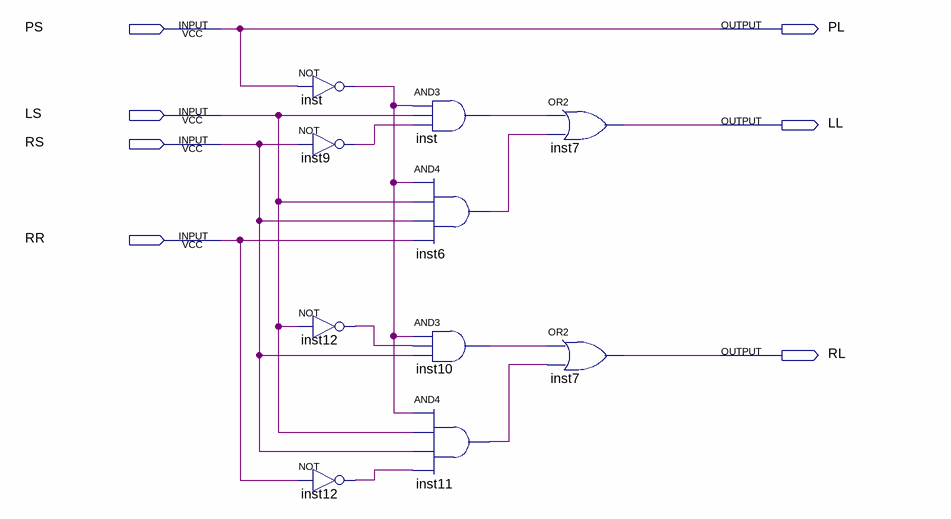
[diagram p0: schematic sheet]
// Quartus schematic Lab01_B0729008_2.bdf as structural Verilog: 10 symbols, 7 pins
module Lab01_B0729008_2 (
  input  PS,
  input  LS,
  input  RS,
  input  RR,
  output PL,
  output LL,
  output RL
);

  wire inst6_out, inst9_out, inst10_out, inst11_out, inst12_out, inst12_out_2, inst_out, inst_out_2;

  not inst (inst_out_2, PS);
  not inst9 (inst9_out, RS);
  not inst12 (inst12_out, LS);
  not inst12_dup2 (inst12_out_2, RR);
  and inst_dup2 (inst_out, inst_out_2, LS, inst9_out);
  and inst6 (inst6_out, inst_out_2, LS, RS, RR);
  and inst10 (inst10_out, inst_out_2, inst12_out, RS);
  and inst11 (inst11_out, inst_out_2, LS, RS, inst12_out_2);
  or inst7 (LL, inst_out, inst6_out);
  or inst7_dup2 (RL, inst10_out, inst11_out);

  assign PL = PS;
endmodule
